# Altium schematic sheet ZUM_Junior.SchDoc: ZUM Core
size A4; Author: Andrés Gullón; DocumentNumber: 1; Revision: 1.G.3; SheetNumber: 1; SheetTotal: 6
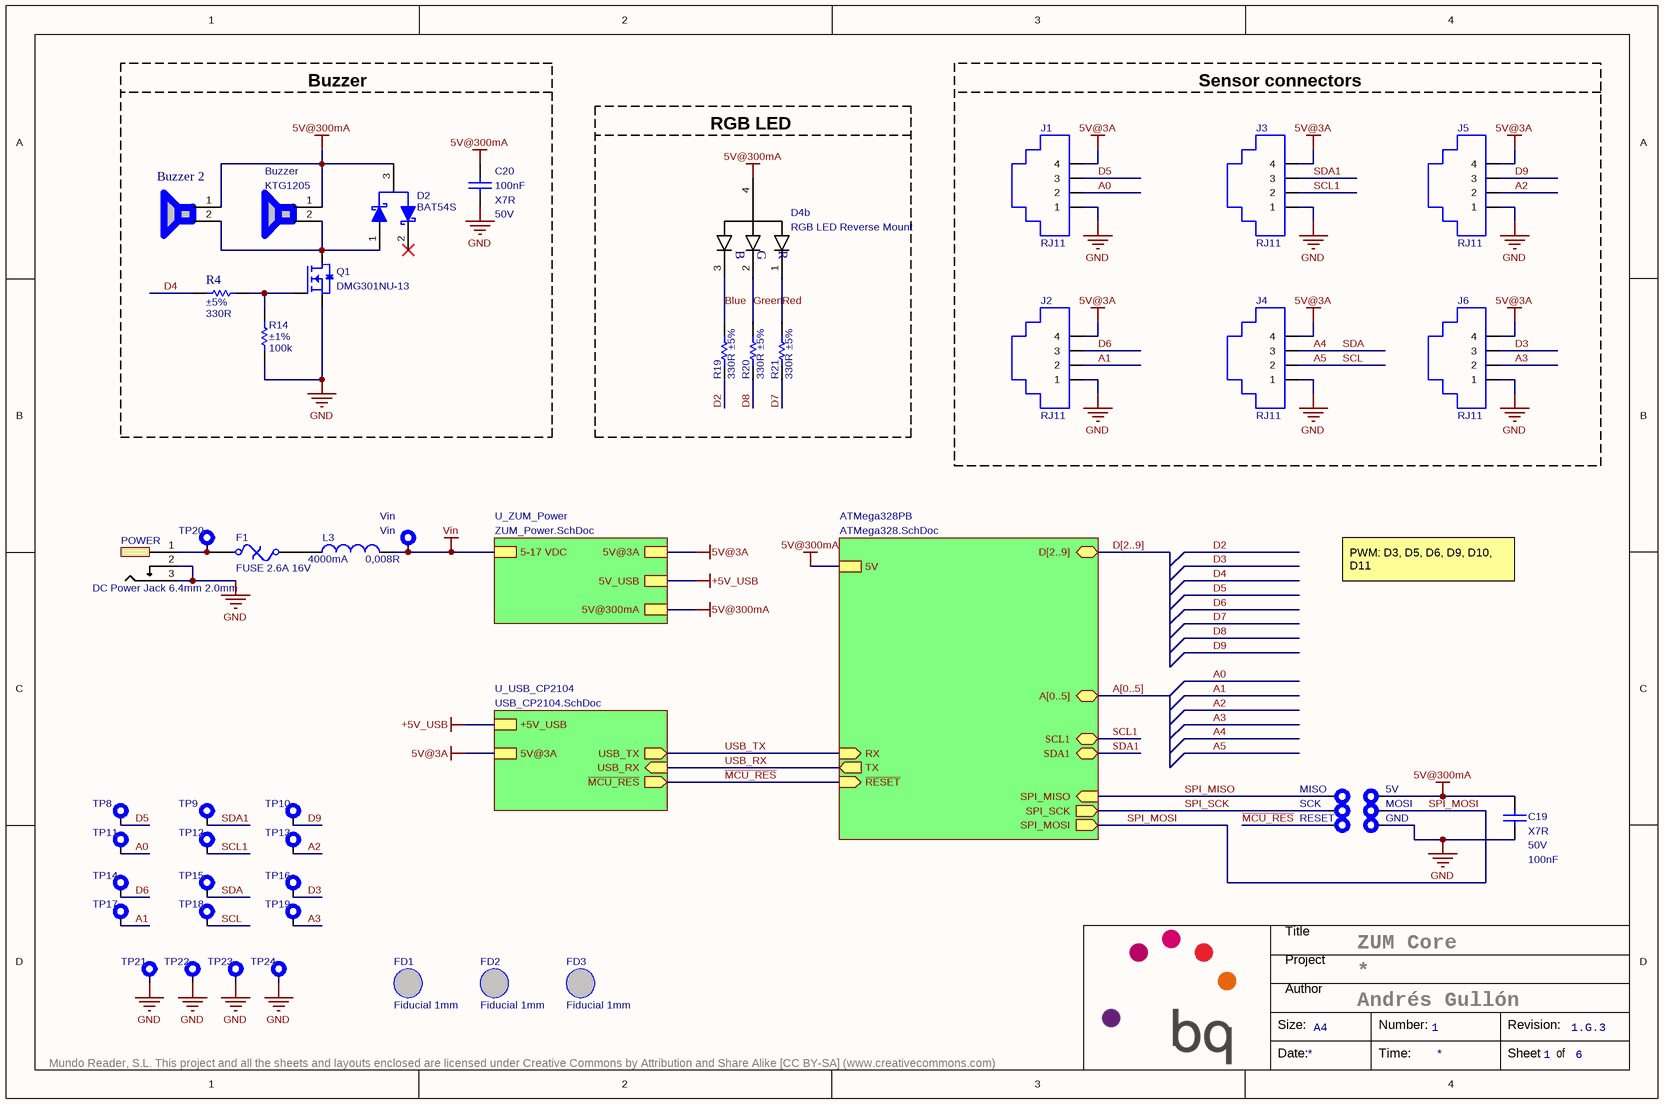
[diagram p0: ZUM_Junior.SchDoc]

## Parts
Buzzer  KTG1205  [BUZZER SMD 13mm]
Buzzer_2  Buzzer 8.5mm SMD  [YX-8014S05-2.7]  (value not drawn)
C19  Dielectric: X7R  Voltage: 50V  Capacitance: 100nF  [C0603]  (hidden comment: C0603_100nF_50V_±10%_X7R)
C20  Dielectric: X7R  Voltage: 50V  Capacitance: 100nF  [C0603]  (hidden comment: C0603_100nF_50V_±10%_X7R)
D2  BAT54S  [SOT23-3]
D4b  RGB LED Reverse Mount  [LED1205 Reverse]
F1  FUSE 2.6A 16V  [F1812]
FD1  Fiducial 1mm  [Fiducial_1mm]  (no BOM)
FD2  Fiducial 1mm  [Fiducial_1mm]  (no BOM)
FD3  Fiducial 1mm  [Fiducial_1mm]  (no BOM)
J1  RJ11  [RJ11 SMD]
J2  RJ11  [RJ11 SMD]
J3  RJ11  [RJ11 SMD]
J4  RJ11  [RJ11 SMD]
J5  RJ11  [RJ11 SMD]
J6  RJ11  [RJ11 SMD]
L3  Resistance_DC: 0,008R  Current: 4000mA  [L0805]  (hidden comment: L0805_33R_0,008R_4000mA)
POWER  DC Power Jack 6.4mm 2.0mm  [694106106102]
Q1  DMG301NU-13  [SOT23-3]
R4  Tolerance: ±5%  Resistance: 330R  [R0402]  (hidden comment: R0402_330R_0.063W_±5%)
R14  Tolerance: ±1%  Resistance: 100k  [R0402]  (hidden comment: R0402_100k_0.063W_±1%)
R19  Tolerance: ±5%  Resistance: 330R  [R0402]  (hidden comment: R0402_330R_0.063W_±5%)
R20  Tolerance: ±5%  Resistance: 330R  [R0402]  (hidden comment: R0402_330R_0.063W_±5%)
R21  Tolerance: ±5%  Resistance: 330R  [R0402]  (hidden comment: R0402_330R_0.063W_±5%)
TP8  TP  [TP_POWER]  (value not drawn)  (no BOM)
TP9  TP  [TP_POWER]  (value not drawn)  (no BOM)
TP10  TP  [TP_POWER]  (value not drawn)  (no BOM)
TP11  TP  [TP_POWER]  (value not drawn)  (no BOM)
TP12  TP  [TP_POWER]  (value not drawn)  (no BOM)
TP13  TP  [TP_POWER]  (value not drawn)  (no BOM)
TP14  TP  [TP_POWER]  (value not drawn)  (no BOM)
TP15  TP  [TP_POWER]  (value not drawn)  (no BOM)
TP16  TP  [TP_POWER]  (value not drawn)  (no BOM)
TP17  TP  [TP_POWER]  (value not drawn)  (no BOM)
TP18  TP  [TP_POWER]  (value not drawn)  (no BOM)
TP19  TP  [TP_POWER]  (value not drawn)  (no BOM)
TP20  TP  [TP_POWER]  (value not drawn)  (no BOM)
TP21  TP  [TP_POWER]  (value not drawn)  (no BOM)
TP22  TP  [TP_POWER]  (value not drawn)  (no BOM)
TP23  TP  [TP_POWER]  (value not drawn)  (no BOM)
TP24  TP  [TP_POWER]  (value not drawn)  (no BOM)
TP25  MISO  [TP_POWER]  (no BOM)
TP26  5V  [TP_POWER]  (no BOM)
TP27  SCK  [TP_POWER]  (no BOM)
TP28  MOSI  [TP_POWER]  (no BOM)
TP29  GND  [TP_POWER]  (no BOM)
TP30  RESET  [TP_POWER]  (no BOM)
Vin  Vin  [TP_POWER]  (no BOM)

## Blocks framed on the sheet
Buzzer: Buzzer Buzzer_2 C20 D2 Q1 R4 R14
Sensor connectors: J1-J6
RGB LED: D4b R19-R21

## Sub-sheets
ATMega328PB = ATMega328.SchDoc: D[2..9] (bidir), A[0..5] (bidir), ~{RESET} (in), 5V, RX (in), TX (out), SPI_MOSI (out), SPI_MISO (in), SPI_SCK (out), SCL1 (bidir), SDA1 (bidir)
U_USB_CP2104 = USB_CP2104.SchDoc: ~{MCU_RES} (out), USB_TX (out), USB_RX (in), +5V_USB, 5V@3A
U_ZUM_Power = ZUM_Power.SchDoc: 5V@3A, 5V_USB, 5-17 VDC, 5V@300mA

## Nets
5V@3A: J1.4 J2.4 J3.4 J4.4 J5.4 J6.4 ; sheet U_USB_CP2104/5V@3A, sheet U_ZUM_Power/5V@3A
5V@300mA: Buzzer.1 Buzzer_2.1 C19.2 C20.2 D2.3(K1) D4b.4 TP26.1 ; sheet ATMega328PB/5V, sheet U_ZUM_Power/5V@300mA
+5V_USB: sheet U_USB_CP2104/+5V_USB, sheet U_ZUM_Power/5V_USB
GND: C19.1 C20.1 J1.1 J2.1 J3.1 J4.1 J5.1 J6.1 POWER.2 POWER.3 Q1.2(S) R14.1 TP21.1 TP22.1 TP23.1 TP24.1 TP29.1
Vin: L3.2 Vin.1 ; sheet U_ZUM_Power/5-17 VDC
A0: J1.2 TP11.1
A1: J2.2 TP17.1
A2: J5.2 TP13.1
A3: J6.2 TP19.1
A4: J4.3 TP15.1  [also labelled SDA]
A5: J4.2 TP18.1  [also labelled SCL]
Blue: D4b.3(B) R19.2
D2: R19.1
D3: J6.3 TP16.1
D4: R4.1
D5: J1.3 TP8.1
D6: J2.3 TP14.1
D7: R21.1
D8: R20.1
D9: J5.3 TP10.1
Green: D4b.2(R) R20.2
~{MCU_RES}: TP30.1 ; sheet ATMega328PB/~{RESET}, sheet U_USB_CP2104/~{MCU_RES}
Red: D4b.1(G) R21.2
SCL1: J3.2 TP12.1 ; sheet ATMega328PB/SCL1
SDA1: J3.3 TP9.1 ; sheet ATMega328PB/SDA1
SPI_MISO: TP25.1 ; sheet ATMega328PB/SPI_MISO
SPI_MOSI: TP28.1 ; sheet ATMega328PB/SPI_MOSI
SPI_SCK: TP27.1 ; sheet ATMega328PB/SPI_SCK
USB_RX: sheet ATMega328PB/TX, sheet U_USB_CP2104/USB_RX
USB_TX: sheet ATMega328PB/RX, sheet U_USB_CP2104/USB_TX
NetBuzzer_2: Buzzer.2 Buzzer_2.2 D2.1(A) Q1.3(D)
NetF1_1: F1.1 POWER.1 TP20.1
NetF1_2: F1.2 L3.1
NetQ1_1: Q1.1(G) R4.2 R14.2

Not connected (* = marked no-connect by the designer): D2 2(K2)*

## Buses and harness runs
bus A[0..5] = sheet ATMega328PB/A[0..5]
bus D[2..9] = sheet ATMega328PB/D[2..9]

## Notes on the sheet
- PWM: D3, D5, D6, D9, D10, D11
- Title
- Project
- Size:
- Author
- A4
- Number:
- Revision:
- Mundo Reader, S.L. This project and all the sheets and layouts enclosed are licensed under Creative Commons by Attribution and Share Alike [CC BY-SA] (www.creativecommons.com)
- Date:
- Time:
- Sheet
- of

## Library data of the parts
Buzzer = CMP-00356-1: Buzzer; Manufacturer: Kingstate Elect.; Description ES: Zumbador; Temp_Max: 85; Temp_Min: 30; SchLibComponentName: BUZZER; Part Number: KTG1205; OrderingCode: KTG1205; Price units: EUR
Buzzer_2 = CMP-00368-3: Manufacturer: Qinlon; Description ES: Zumbador SMD 9.5mm; OrderingCode: YX-8014S-05; Temp_Max: 70; Temp_Min: -30; Part Number: YX-8014S-05; Value: Buzzer
C19 C20 = CMP-00257-1: Manufacturer: Kemet; Description ES: Condensador; OrderingCode: C0603C104K5RAC; OrderingCode 2: 06035C104KAT2A; SchLibComponentName: Capacitor; Temp_ Max: 125; Temp_ Min: -55; Tolerance: ±10%; Value: 100nF ±10% 50V; Manufacturer 2: AVX; Part Number: C0603_100nF_50V_±10%_X7R; Price units: EUR
D2 = CMP-A2299-1: Schottky Diode; Manufacturer: NXP; SchLibComponentName: Dual Schottky; Ifor: 200mA; Vrrm: 30V; Ifsm: 600mA; Vf: 0,8V; Description ES: Diodo Schottky; Temp_Max: 150; Temp_Min: -55; Lead time: 8 wks; Value: 200mA 30V; Part Number: BAT54S; OrderingCode: BAT54S; Supplier cod: AC1190; Price units: EUR; Manufacturer 2: Vishay; OrderingCode 2: BAT54S
D4b = CMP-00366-1: Manufacturer: WÜrth Elektronik; Description ES: LED RGB Montado del revés; OrderingCode: 156125M173000; Temp_Max: 85; Temp_Min: -40; Value: RGB LED Rev.; Part Number: RGB LED Reverse
F1 = CMP-A2427-2: Resettable Fuses; Part Number: FUSE 2.5A 16V; Manufacturer: Bel Fuse; Current: 2.5A; OrderingCode: 0ZCG0260BF2B; Description ES: Fusible reseteable; Temp_ Max: 85; Temp_ Min: -40; Lead time: 12 wks; OrderingCode 2: MINISMDC260F/16-2; OrderingCode 3: MF-MSMF250/16X-2; SchLibComponentName: PTC_Fuse; Voltage: 16V; Price units: EUR; Manufacturer 2: Littelfuse; Manufacturer 3: Bourns
FD1-FD3 = CMP-A2525-2: Fiducial; Description ES: Marca fiducial; SchLibComponentName: Fiducial; Part Number: Fiducial 1mm
J1-J6 = CMP-00353-5: RJ11 4p4c SMD; Manufacturer: Kycon; OrderingCode: GMX-SMT2-N-44-TR; OrderingCode 2: 7641 – T441; OrderingCode 4: 95501-6449; Temp_Max: 85; Temp_Min: -40; Description ES: RJ11 4p4c SMD; Manufacturer 2: Cenvalsa; Manufacturer 4: Molex; Part Number: RJ11; Price units: EUR
L3 = CMP-A0714-1: Manufacturer: Würth Elektronik; SchLibComponentName: Ferrite Bead; Resistance_100MHz: 33R; OrderingCode: 742792012; Temp_ Max: 125; Temp_ Min: -55; Value: 33R 0,008R 4000mA; Part Number: L0805_33R_0,008R_4000mA; Price units: EUR
POWER = CMP-00354-1: Manufacturer: Würth Elektronik; Temp_Max: 85; Temp_Min: -40; Value: DC Jack; Description ES: DC Power Jack 6.4mm 2.0mm; OrderingCode: 694106106102; Part Number: 694106106102; Price units: €
Q1 = CMP-A2386-5: N-MOSFET transistor; Manufacturer: Diodes; Vds: 25V; Vgss: 8V; Id: 0,26A; Description ES: Transistor MOSFET de canal N; Temp_ Max: 150; Temp_ Min: -55; SchLibComponentName: Mosfet_N; Part Number: DMG301NU-13; OrderingCode: DMG301NU-13; Price units: EUR
R4 R19-R21 = CMP-A1762-2: Manufacturer: Vishay; OrderingCode: CRCW0402330RJN; Power: 0.063W; Value: 330R ±5% 0.063W; Temp_ Max: 155; Temp_ Min: -55; Description ES: Resistencia; SchLibComponentName: Resistor; PackageDescription: SMD; Part Number: R0402_330R_0.063W_±5%; Price units: EUR
R14 = CMP-A1835-2: Manufacturer: Vishay; Value: 100k ±1% 0.063W; SchLibComponentName: Resistor; OrderingCode: CRCW0402100KFK; Power: 0.063W; Temp_ Max: 155; Temp_ Min: -55; Description ES: Resistencia; PackageDescription: SMD; Part Number: R0402_100k_0.063W_±1%; Price units: EUR
TP8-TP30 Vin = CMP-A2499-3: Testpoint 0.3mm; Manufacturer: Oxley; OrderingCode: SMOX/060/B1; SAP: 303552; SchLibComponentName: Testpoint; Part Number: TP_POWER; Price units: EUR